# Altium schematic sheet Sheet2.SchDoc
size A4; SheetNumber: 1; SheetTotal: 1
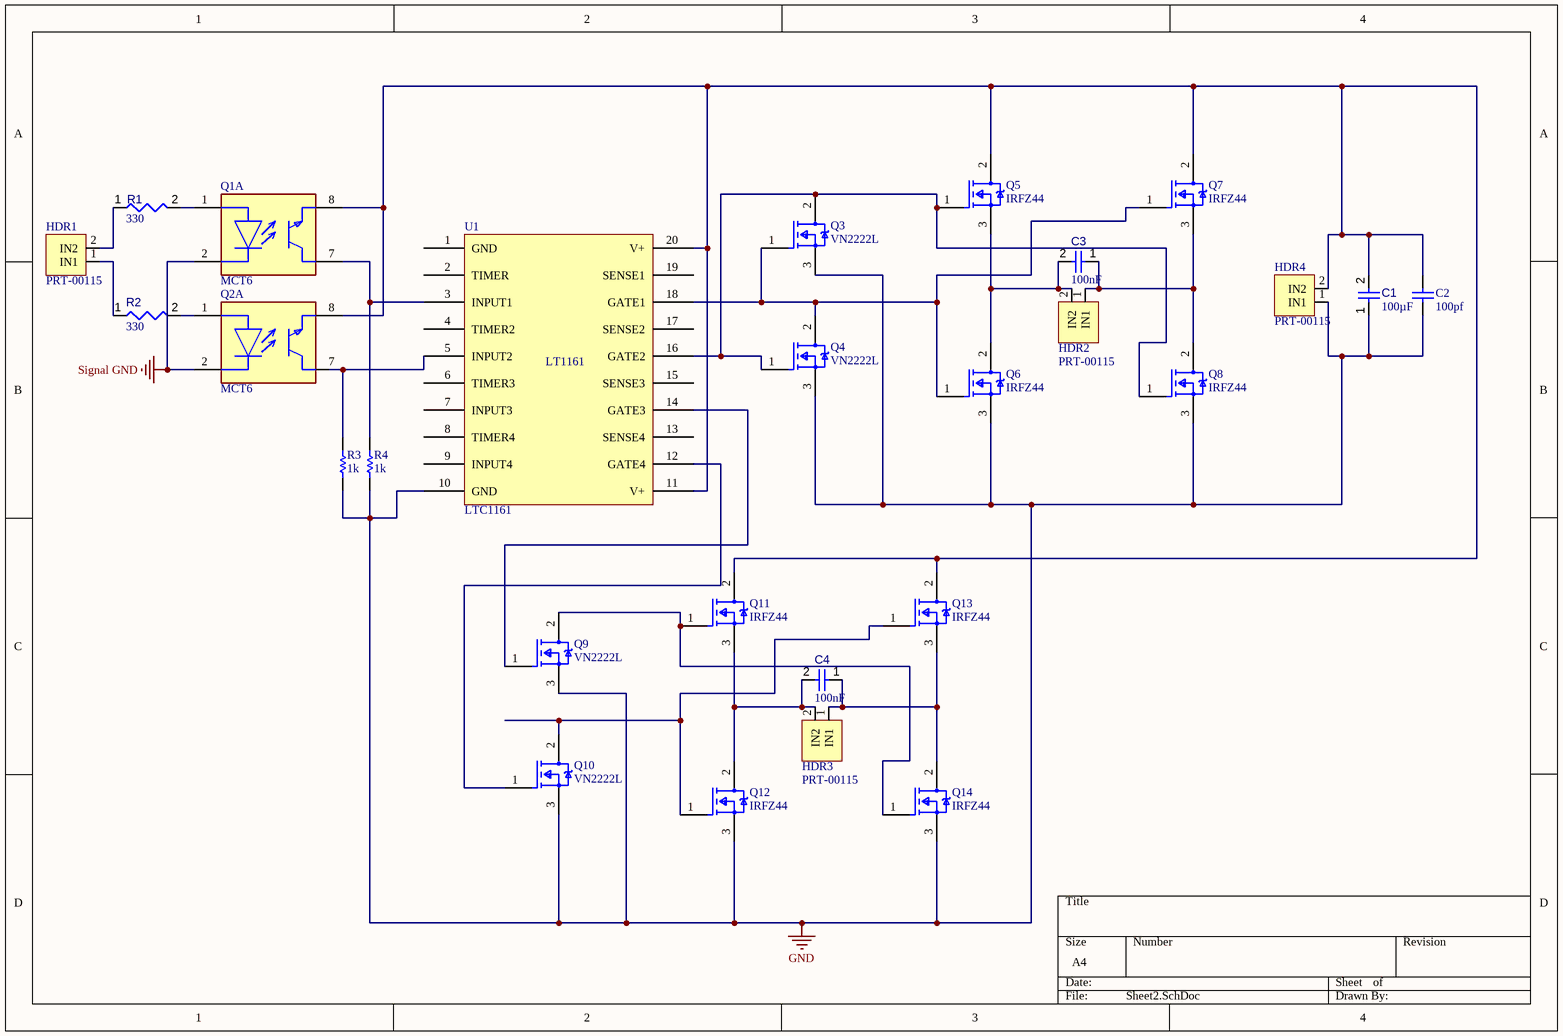
[diagram p0: Sheet2.SchDoc]

## Parts
C1  value 100µF  [CAPC3216X190X55LL30T25]  (hidden comment: Capacitor 100 uF +/- 20% 6.3 V 1206)
C2  100pf  [CAPC1608X90X40ML10T20]
C3  value 100nF  [CAPC0402(1005)60_L]  (hidden comment: Capacitor 100nF +/-20% 10V 0402)
C4  value 100nF  [CAPC0402(1005)60_L]  (hidden comment: Capacitor 100nF +/-20% 10V 0402)
HDR1  PRT-00115
HDR2  PRT-00115
HDR3  PRT-00115
HDR4  PRT-00115
Q1  MCT6  [FP-646CQ-MFG]  (part A of 2)
Q2  MCT6  [FP-646CQ-MFG]  (part A of 2)
Q3  VN2222L  [FP-PG-TO220-3-MFG]
Q4  VN2222L  [FP-PG-TO220-3-MFG]
Q5  IRFZ44  [FP-PG-TO220-3-MFG]
Q6  IRFZ44  [FP-PG-TO220-3-MFG]
Q7  IRFZ44  [FP-PG-TO220-3-MFG]
Q8  IRFZ44  [FP-PG-TO220-3-MFG]
Q9  VN2222L  [FP-PG-TO220-3-MFG]
Q10  VN2222L  [FP-PG-TO220-3-MFG]
Q11  IRFZ44  [FP-PG-TO220-3-MFG]
Q12  IRFZ44  [FP-PG-TO220-3-MFG]
Q13  IRFZ44  [FP-PG-TO220-3-MFG]
Q14  IRFZ44  [FP-PG-TO220-3-MFG]
R1  value 330  [RESC0402(1005)_L]  (hidden comment: Resistor 330R +/-5 % 0402 63 mW)
R2  value 330  [RESC0402(1005)_L]  (hidden comment: Resistor 330R +/-5 % 0402 63 mW)
R3  value 1k  [RESC3116X70X50ML13T20]  (hidden comment: Resistor 1k +/-1% 1206 250 mW)
R4  value 1k  [RESC3116X70X50ML13T20]  (hidden comment: Resistor 1k +/-1% 1206 250 mW)
U1  LTC1161

## Nets
GND: C1.1 C2.1 HDR4.1(IN1) Q3.3(SOURCE) Q4.3(SOURCE) Q6.3(SOURCE) Q8.3(SOURCE) Q9.3(SOURCE) Q10.3(SOURCE) Q12.3(SOURCE) Q14.3(SOURCE) R3.1 R4.1 U1.10(GND)
Signal GND: Q1.2(1_CATHODE) Q2.2(1_CATHODE)
NetC1_2: C1.2 C2.2 HDR4.2(IN2) Q1.8(E) Q2.8(E) Q5.2(DRAIN) Q7.2(DRAIN) Q11.2(DRAIN) Q13.2(DRAIN) U1.11(V+) U1.20(V+)
NetC3_1: C3.1 HDR2.1(IN1) Q7.3(SOURCE) Q8.2(DRAIN)
NetC3_2: C3.2 HDR2.2(IN2) Q5.3(SOURCE) Q6.2(DRAIN)
NetC4_1: C4.1 HDR3.1(IN1) Q13.3(SOURCE) Q14.2(DRAIN)
NetC4_2: C4.2 HDR3.2(IN2) Q11.3(SOURCE) Q12.2(DRAIN)
NetHDR1_1: HDR1.1(IN1) R2.1
NetHDR1_2: HDR1.2(IN2) R1.1
NetQ1_1: Q1.1(1_ANODE) R1.2
NetQ1_7: Q1.7(C) R4.2 U1.3(INPUT1)
NetQ2_1: Q2.1(1_ANODE) R2.2
NetQ2_7: Q2.7(C) R3.2 U1.5(INPUT2)
NetQ3_1: Q3.1(GATE) Q4.2(DRAIN) Q6.1(GATE) Q7.1(GATE) U1.18(GATE1)
NetQ3_2: Q3.2(DRAIN) Q4.1(GATE) Q5.1(GATE) Q8.1(GATE) U1.16(GATE2)
NetQ9_1: Q9.1(GATE) U1.14(GATE3)
NetQ9_2: Q9.2(DRAIN) Q11.1(GATE) Q14.1(GATE)
NetQ10_1: Q10.1(GATE) U1.12(GATE4)
NetQ10_2: Q10.2(DRAIN) Q12.1(GATE) Q13.1(GATE)

Not connected (* = marked no-connect by the designer): U1 1(GND) 2(TIMER) 4(TIMER2) 6(TIMER3) 7(INPUT3) 8(TIMER4) 9(INPUT4) 13(SENSE4) 15(SENSE3) 17(SENSE2) 19(SENSE1)

## Notes on the sheet
- (in symbol LTC1161) LT1161

## Library data of the parts
C1 = CMP-001-00019-6: Chip Capacitor, 100 uF, +/- 20%, 6.3 V, 1206 (3216 Metric); Voltage Rating: 6.3V; Capacitor Type: Ceramic; Tolerance: 20%; Pins: 2; Case/Package: 1206; Max Operating Temperature: 85°C; RoHS Compliant: True; Mounting Technology: SM; Min Operating Temperature: -55°C
C2 = CMP-2100-03594-1: Chip Capacitor, 100 pF, +/- 5%, 50 V, -55 to 125 degC, 0603 (1608 Metric), RoHS, Tape and Reel; Manufacturer: Yageo; Voltage Rating (DC): 50V; Dielectric: C0G; Temperature Coefficient: 30ppm/degC; Insulation Resistance: 100GR; Datasheet Version: Rev. 14, 07/2016; Manufacturer URL: http://www.yageo.com/; Packaging: TapeandReel; Mount: SurfaceMount; RoHSCompliant: True; Package Reference: 0603; Tolerance: 5%; Max Operating Temperature: 125degC; Case Code (Imperial): 0603; Capacitance: 100pF; Number of Pins: 2; Width: 0.8mm; Case Code (Metric): 1608; Voltage: 50V; REACH SVHC: Unknown; Package Description: 2-Pin Surface Mount Device, Body 1.6 x 0.8 mm; Composition: Ceramic; Lead Free: LeadFree; Min Operating Temperature: -55degC; Radiation Hardening: No; Depth: 0.8mm; Thickness: 0.035inch; Datasheet URL: http://www.yageo.com/documents/recent/UPY-GP_NP0_16V-to-50V_14.pdf; Termination: SMD/SMT; Package Quantity: 1; Length: 1.6mm; Voltage Rating: 50V; Height: 0.8mm; Case/Package: 0603
C3 C4 = CMP-001-00061-3: Chip Capacitor, 100nF +/-20%, 10V, 0402, Thickness 0.6 mm; Tolerance: 20%; Mounting Technology: SMT; Voltage Rating: 10V; Max Operating Temperature: 85°C; Pins: 2; Case/Package: 0402; Min Operating Temperature: -55°C
Q1 Q2 = CMP-00278-84329801-1: MCT6 Optocoupler DC-IN 2-CH Transistor DC-OUT 8-Pin PDIP Black Bulk - Rail/Tube; Manufacturer Lifecycle Status: ACTIVE; Forward Current: 60mA; Forward Voltage: 1.5V; Number of Channels: 2; Collector Emitter Saturation Voltage: 400mV; Current Transfer Ratio: 50%; Input Current: 20mA; Reverse Breakdown Voltage: 25V; Rise Time: 2.4µs; Output Voltage: 30V; Max Collector Current: 30mA; Max Power Dissipation: 400mW; Isolation Voltage: 5kV; Case/Package: PDIP; Radiation Hardening: No; Number of Pins: 8; Contact Plating: Tin; Length: 10.18mm; Collector Emitter Voltage (VCEO): 400mV; Schedule B: 8541408000, 8541408000; Width: 7mm; Packaging: Bulk; Max Operating Temperature: 100°C; REACH SVHC: No SVHC; Number of Elements: 2; Lifecycle Status: Production; Weight: 774mg; Max Input Current: 60mA; Output Current per Channel: 30mA; Max Output Voltage: 30V; Mount: Through Hole; Number of Circuits: 2; RoHS: Compliant; Lead Free: Lead Free; NexarPartId: 84329801; Power Dissipation: 400mW; Height: 4mm; Min Operating Temperature: -55°C
Q3-Q14 = CMP-32901-001154-1: MOSFET N-CH 60V 55A TO220AB; Polarization: N; Power Dissipation: 115W; Rds On Max: 16.5mR; Gate to Source Voltage (Vgs): 20V; Threshold Voltage: 4V; Turn-On Delay Time: 13ns; Element Configuration: Single; Input Capacitance: 1.812nF; Turn-Off Delay Time: 40ns; Mount: Through Hole; Drain to Source Voltage (Vdss): 60V; Max Dual Supply Voltage: 60V; Length: 0.42inch; Height: 0.65inch; Width: 0.19inch; Packaging: Rail/Tube; Halogen Free: Halogen Free; Number of Pins: 3; Continuous Drain Current (ID): 55A; Drain to Source Resistance: 16.5mR; Series: HEXFET®; RoHS Compliant: Yes; Reach SVHC Compliant: Yes; Drain to Source Breakdown Voltage: 60V; Max Operating Temperature: 175°C; Case/Package: TO-220; Max Power Dissipation: 115W; Lead Free: Lead Free; Min Operating Temperature: -55°C
R1 R2 = CMP-009-00132-3: Chip Resistor, 330 Ohms, +/-5 %, 63 mW, -55 to 155 degC, 0402; Power: 63mW; Tolerance: 5%; Pins: 2; Max Operating Temperature: 155°C; Min Operating Temperature: -55°C; Case/Package: 0402
R3 R4 = CMP-009-00011-5: Chip Resistor, 1 KOhm, +/- 1%, 0.25 W, -55 to 155 degC, 1206 (3216 Metric); Voltage Rating: 200V; Power: 250mW; Max Operating Temperature: 155°C; Mounting Technology: SM; Tolerance: 1%; Case/Package: 1206; RoHS Compliant: True; Min Operating Temperature: -55°C; Pins: 2